# EAGLE design MurataBLE (EAGLE 7.5.0)
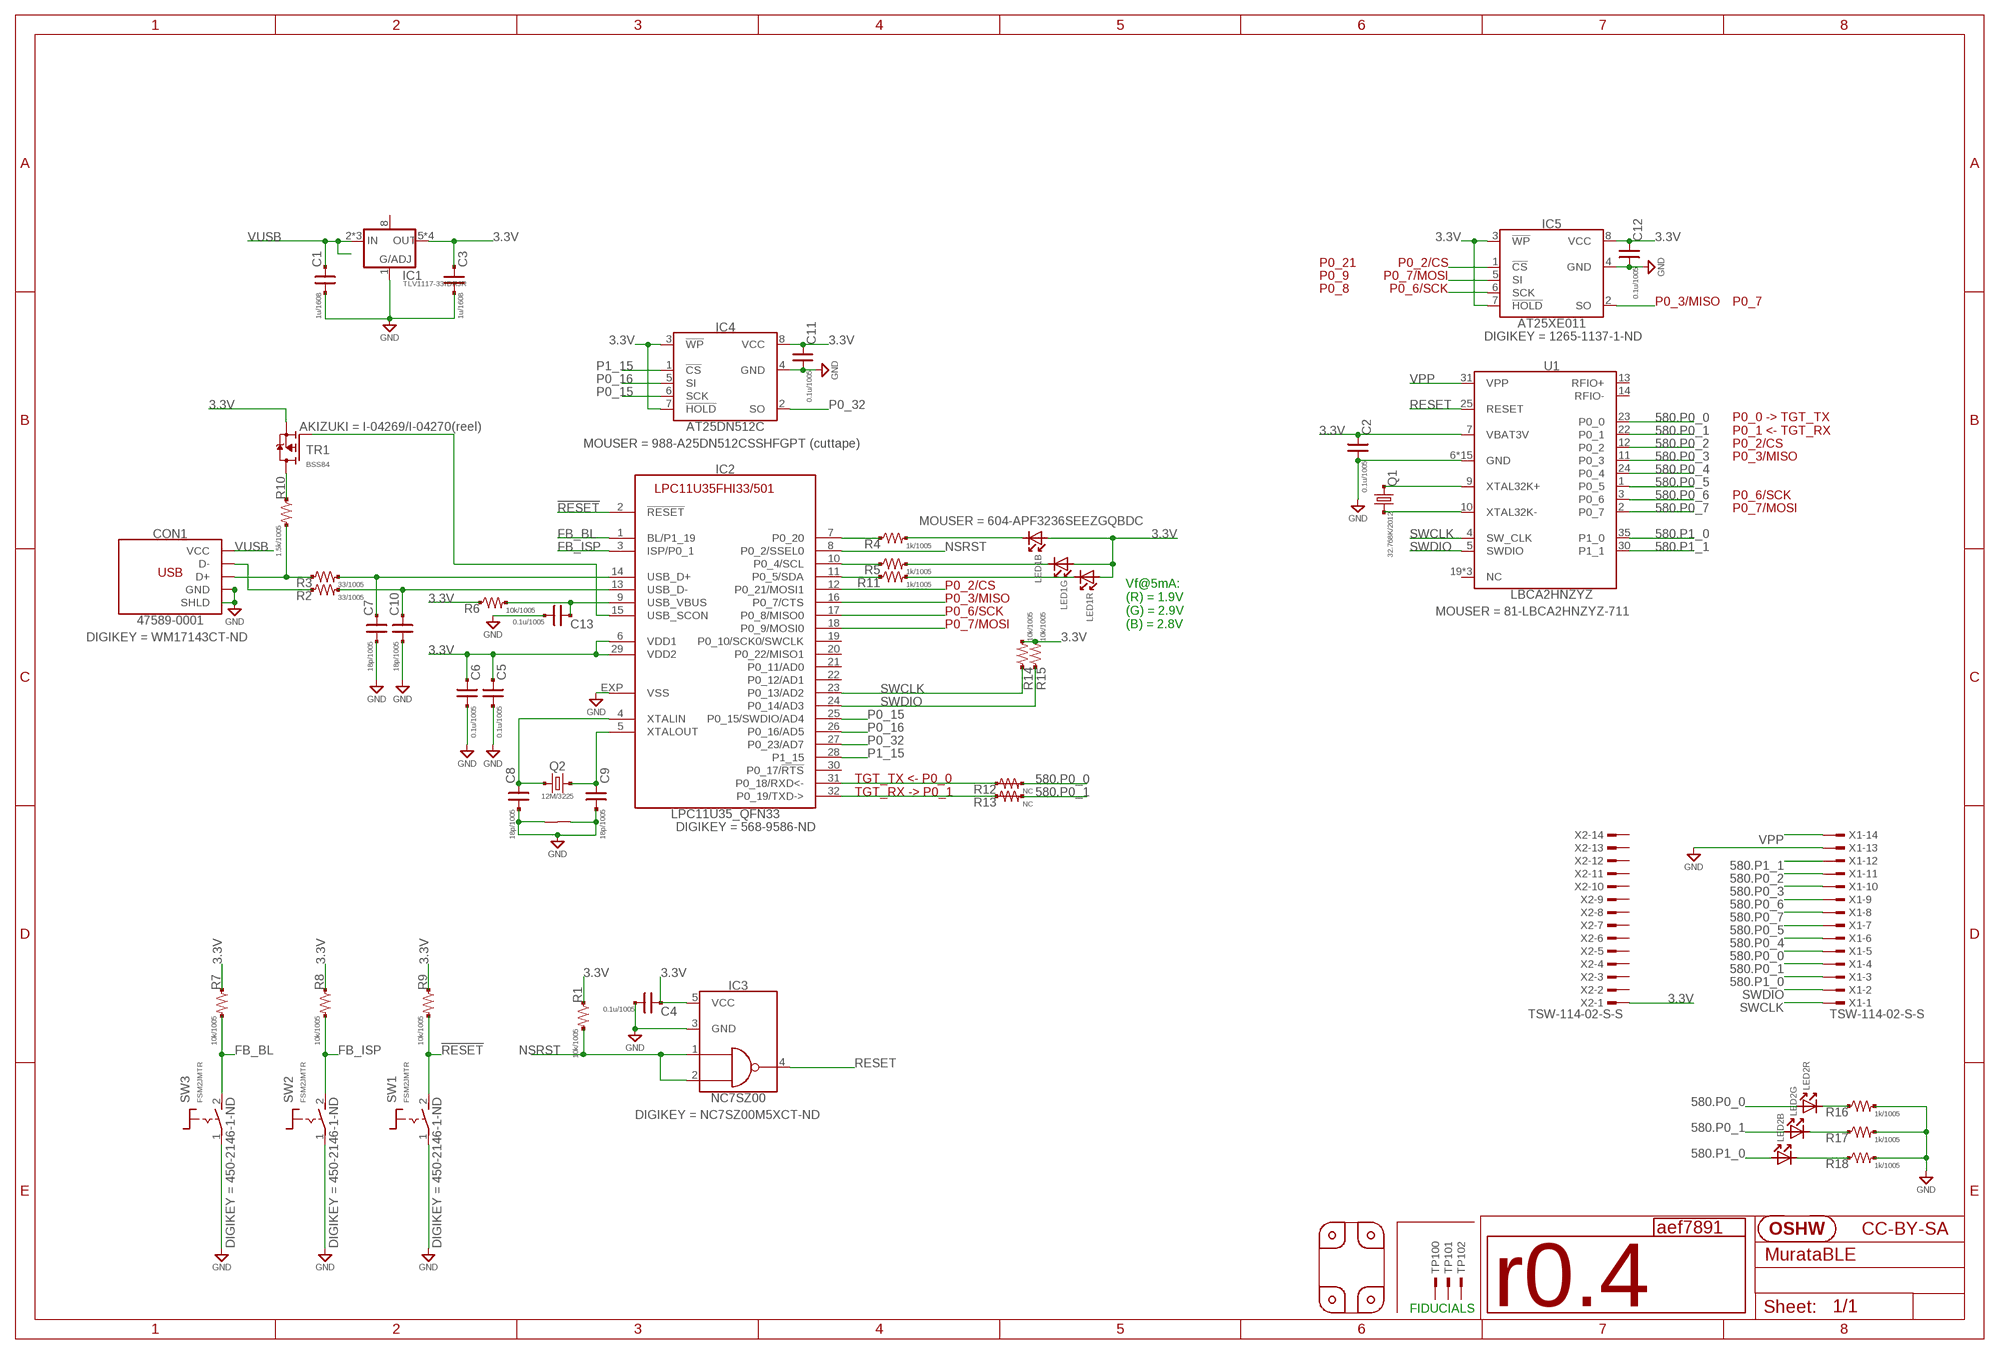
[diagram p0: schematic, sheet 1]

## Parts
C1  1u/1608  C_SMD_1.0U_1608  [CR_1608]
C2  0.1u/1005  C_SMD_0.1U_1005  [C0402]
C3  1u/1608  C_SMD_1.0U_1608  [CR_1608]
C4  0.1u/1005  C_SMD_0.1U_1005  [C0402]
C5  0.1u/1005  C_SMD_0.1U_1005  [C0402]
C6  0.1u/1005  C_SMD_0.1U_1005  [C0402]
C7  18p/1005  C_SMD_18P_1005  [C0402]
C8  18p/1005  C_SMD_18P_1005  [C0402]
C9  18p/1005  C_SMD_18P_1005  [C0402]
C10  18p/1005  C_SMD_18P_1005  [C0402]
C11  0.1u/1005  C_SMD_0.1U_1005  [C0402]
C12  0.1u/1005  C_SMD_0.1U_1005  [C0402]
C13  0.1u/1005  C_SMD_0.1U_1005  [C0402]
CON1  47589-0001  CON_USB_UB  [CON_USB_47589-0001MOLEX]
GIT1  aef7891  GIT-REVISION  [GIT-REVISION]
IC1  TLV1117-33IDRJR  LDO4_3.3_DRJ  [DFN80P410X410_8N]
IC2  LPC11U35_QFN33  IC_LPC11U35_QFN33_5X5  [HVQFN33]
IC3  NC7SZ00  IC_TTL_SINGLE_74_00_SOT23  [SOT95P280X145-5N]
IC4  AT25DN512C  IC_MEMORY_8P_AT25DN512C_SOP  [IC_08_1.27_150MIL]
IC5  AT25XE011  IC_MEMORY_8P_AT25XE011_SOP  [IC_08_1.27_150MIL]
ICON1  r0.4  ICON_REVISION_1.2  [ICON_REVISION1.2]
ICON2  NC  ICON_OSHW  [ICON_OSHW]
LED1  LED_3SEG  [LED_3SEG_SMD]
LED2  LED_3SEG  [LED_3SEG_SMD]
P1  NC  PCB_CORNER_NH  [PCB_CORNER_NH]
P2  NC  PCB_CORNER_NH  [PCB_CORNER_NH]
P3  NC  PCB_CORNER_NH  [PCB_CORNER_NH]
P4  NC  PCB_CORNER_NH  [PCB_CORNER_NH]
Q1  32.768K/2012  CRYSTAL2_32.768K_2012  [CR_2125]
Q2  12M/3225  CRYSTAL4_12M_3225  [CLOCK_3225]
R1  10k/1005  R_US_10K_1005  [C0402]
R2  33/1005  R_US_33R_1005  [C0402]
R3  33/1005  R_US_33R_1005  [C0402]
R4  1k/1005  R_US_1.0K_1005  [C0402]
R5  1k/1005  R_US_1.0K_1005  [C0402]
R6  10k/1005  R_US_10K_1005  [C0402]
R7  10k/1005  R_US_10K_1005  [C0402]
R8  10k/1005  R_US_10K_1005  [C0402]
R9  10k/1005  R_US_10K_1005  [C0402]
R10  1.5k/1005  R_US_1.5K_1005  [C0402]
R11  1k/1005  R_US_1.0K_1005  [C0402]
R12  NC  R_US__1005SHORT  [R0402SHORT]
R13  NC  R_US__1005SHORT  [R0402SHORT]
R14  10k/1005  R_US_10K_1005  [C0402]
R15  10k/1005  R_US_10K_1005  [C0402]
R16  1k/1005  R_US_1.0K_1005  [C0402]
R17  1k/1005  R_US_1.0K_1005  [C0402]
R18  1k/1005  R_US_1.0K_1005  [C0402]
SW1  FSM2JMTR  TACTSW2_FSM2JMTR  [SW_TACTSW_FSM2JMTR]
SW2  FSM2JMTR  TACTSW2_FSM2JMTR  [SW_TACTSW_FSM2JMTR]
SW3  FSM2JMTR  TACTSW2_FSM2JMTR  [SW_TACTSW_FSM2JMTR]
TP100  NC  TESTPAD_F  [FIDUCIAL]
TP101  NC  TESTPAD_F  [FIDUCIAL]
TP102  NC  TESTPAD_F  [FIDUCIAL]
TR1  BSS84  PMOS_BSS84_SOT23  [SOT95P300X140-3N]
U1  LBCA2HNZYZ  LBCA2HNZYZ-711  [IC_MURATA_LBCA2HNZYZ-711]
X1  TSW-114-02-S-S  [TSW-114-07-F-S]
X2  TSW-114-02-S-S  [TSW-114-07-F-S]

## Nets
3.3V: C2.1 C3.1 C4.1 C5.1 C6.1 C11.1 C12.1 IC1.5(OUT) IC1.6(OUT) IC1.7(OUT) IC1.EP(OUT) IC2.6(VDD1) IC2.29(VDD2) IC3.5(VCC) IC4.3(!WP) IC4.7(!HOLD) IC4.8(VCC) IC5.3(!WP) IC5.7(!HOLD) IC5.8(VCC) LED1.4(R:A) LED1.5(G:A) LED1.6(B:A) R1.1 R6.1 R7.1 R8.1 R9.1 R14.2 R15.2 TR1.2(S) U1.7(VBAT3V) X2.1
580.P0_0: LED2.4(R:A) R12.3 U1.23(P0_0) X1.5
580.P0_1: LED2.5(G:A) R13.3 U1.22(P0_1) X1.4
580.P0_2: IC2.12(P0_21/MOSI1) IC5.1(!CS) U1.12(P0_2) X1.11
580.P0_3: IC2.16(P0_7/CTS) IC5.2(SO) U1.11(P0_3) X1.10
580.P0_4: U1.24(P0_4) X1.6
580.P0_5: U1.1(P0_5) X1.7
580.P0_6: IC2.17(P0_8/MISO0) IC5.6(SCK) U1.3(P0_6) X1.9
580.P0_7: IC2.18(P0_9/MOSI0) IC5.5(SI) U1.2(P0_7) X1.8
580.P1_0: LED2.6(B:A) U1.35(P1_0) X1.3
580.P1_1: U1.30(P1_1) X1.12
!RESET!: IC2.2(!RESET!) R9.2 SW1.2(S)
FB_BL: IC2.1(BL/P1_19) R7.2 SW3.2(S)
FB_ISP: IC2.3(ISP/P0_1) R8.2 SW2.2(S)
GND: C1.2 C2.2 C3.2 C4.2 C5.2 C6.2 C7.2 C8.2 C9.2 C10.2 C11.2 C12.2 C13.2 CON1.5(GND) CON1.SHD$1(SHLD) CON1.SHD$2(SHLD) CON1.SHD$3(SHLD) CON1.SHD$4(SHLD) CON1.SHD$5(SHLD) CON1.SHD$6(SHLD) CON1.SHD$7(SHLD) CON1.SHD(SHLD) IC1.1(ADJ) IC2.EXP(VSS) IC3.3(GND) IC4.4(GND) IC5.4(GND) Q2.2 Q2.4 R16.2 R17.2 R18.2 SW1.1(P) SW2.1(P) SW3.1(P) U1.6(GND) U1.8(GND) U1.15(GND) U1.16(GND) U1.17(GND) U1.18(GND) U1.20(GND) U1.21(GND) U1.26(GND) U1.27(GND) U1.28(GND) U1.29(GND) U1.32(GND) U1.33(GND) U1.34(GND) X1.13
N$2: Q1.1 U1.9(XTAL32K+)
N$3: Q1.2 U1.10(XTAL32K-)
N$4: C13.1 IC2.9(USB_VBUS) R6.2
N$6: R10.1 TR1.3(D)
N$7: IC2.15(USB_SCON) TR1.1(G)
N$8: IC2.7(P0_20) R4.1
N$9: IC2.10(P0_4/SCL) R5.1
N$10: IC2.11(P0_5/SDA) R11.1
N$11: LED1.1(R:K) R11.2
N$12: LED1.2(G:K) R5.2
N$13: LED1.3(B:K) R4.2
N$14: LED2.3(B:K) R18.1
N$15: LED2.2(G:K) R17.1
N$16: LED2.1(R:K) R16.1
N$18: C8.1 IC2.4(XTALIN) Q2.1
N$19: C9.1 IC2.5(XTALOUT) Q2.3
N$20: C7.1 IC2.14(USB_D+) R3.2
N$21: CON1.3(D+) R3.1 R10.2
N$22: CON1.2(D-) R2.1
N$24: C10.1 IC2.13(USB_D-) R2.2
NSRST: IC2.8(P0_2/SSEL0) IC3.1(1A) IC3.2(1B) R1.2
P0_15: IC2.25(P0_15/SWDIO/AD4) IC4.6(SCK)
P0_16: IC2.26(P0_16/AD5) IC4.5(SI)
P0_32: IC2.27(P0_23/AD7) IC4.2(SO)
P1_15: IC2.28(P1_15) IC4.1(!CS)
RESET: IC3.4(1Y) U1.25(RESET)
SWCLK: IC2.23(P0_13/AD2) R14.1 U1.4(SW_CLK) X1.1
SWDIO: IC2.24(P0_14/AD3) R15.1 U1.5(SWDIO) X1.2
TGT_RX: IC2.32(P0_19/TXD->) R13.1 R13.2
TGT_TX: IC2.31(P0_18/RXD<-) R12.1 R12.2
VPP: U1.31(VPP) X1.14
VUSB: C1.1 CON1.1(VCC) IC1.2(IN) IC1.3(IN) IC1.4(IN)
Unconnected: IC1.8(OUT/EN/NC) IC2.19(P0_10/SCK0/SWCLK) IC2.20(P0_22/MISO1) IC2.21(P0_11/AD0) IC2.22(P0_12/AD1) IC2.30(P0_17/!RTS!) TP100.TP TP101.TP TP102.TP U1.13(RFIO+) U1.14(RFIO-) U1.19(NC) U1.36(NC) U1.37(NC) X2.2 X2.3 X2.4 X2.5 X2.6 X2.7 X2.8 X2.9 X2.10 X2.11 X2.12 X2.13 X2.14

## Notes on the sheet
- P0_21 | P0_2/CS
- P0_9 | P0_7/MOSI
- P0_8 | P0_6/SCK
- P0_3/MISO | P0_7
- P0_0 -> TGT_TX
  P0_1 <- TGT_RX
- P0_2/CS
- P0_3/MISO
- P0_6/SCK
- P0_7/MOSI
- P0_2/CS
- P0_3/MISO
- P0_6/SCK
- P0_7/MOSI
- Vf@5mA:
  (R) = 1.9V
  (G) = 2.9V
  (B) = 2.8V
- TGT_TX <- P0_0
  TGT_RX -> P0_1
- CC-BY-SA
- FIDUCIALS

## Library data of the parts
C1 C3 = mylib:C_SMD_*: SMD CAPACITOR; SEEED: 302010139
C2 C4-C6 C11-C13 = mylib:C_SMD_*: SMD CAPACITOR; DIGIKEY: 490-3261-1-ND; SEEED: 302010024
C7-C10 = mylib:C_SMD_*: SMD CAPACITOR; DIGIKEY: 490-5858-1-ND; SEEED: 302010016
CON1 = mylib:CON_USB: USB B CONNECTOR; DIGIKEY: WM17143CT-ND
GIT1 = git-revision:GIT-REVISION; NOT_COMPONENT: YES
IC1 = mylib:LDO4_*: LDO with 4 pins; DIGIKEY: 296-32364-1-ND
IC2 = mylib:IC_LPC11U*_QFN33; DIGIKEY: 568-9586-ND; SEEED: 310010053
IC3 = mylib:IC_TTL_SINGLE_74_00: SINGLE 2-INPUT POSITIVE-OR GATE; DIGIKEY: NC7SZ00M5XCT-ND
IC4 = mylib:IC_MEMORY_8P_*; MOUSER: 988-A25DN512CSSHFGPT (cuttape)
IC5 = mylib:IC_MEMORY_8P_*; DIGIKEY: 1265-1137-1-ND
ICON1 = mylib:ICON_REVISION; NOT_COMPONENT: YES
ICON2 = mylib:ICON_OSHW: Silk icon of OSHW; NOT_COMPONENT: YES
LED1 LED2 = mylib:LED_3SEG: Vf@5mA: (R) = 1.9V (G) = 2.9V (B) = 2.8V; MOUSER: 604-APF3236SEEZGQBDC
P1-P4 = mylib:PCB_CORNER; NOT_COMPONENT: YES
Q1 = mylib:CRYSTAL2_*; DIGIKEY: 1253-1342-1-ND
Q2 = mylib:CRYSTAL4_*: Crystal 4 pins; DIGIKEY: 1253-1168-1-ND
R1 R6-R9 R14 R15 = mylib:R_US_*: SMD resistor Packages : _1608 : 1.6 x 0.8 mm _2125 : 2.0 x 1.25 mm _3216 : 3.2 x 1.6 mm; DIGIKEY: P10.0KLCT-ND; SEEED: 301010047
R2 R3 = mylib:R_US_*: SMD resistor Packages : _1608 : 1.6 x 0.8 mm _2125 : 2.0 x 1.25 mm _3216 : 3.2 x 1.6 mm; DIGIKEY: P33.0LCT-ND; SEEED: 301010609
R4 R5 R11 R16-R18 = mylib:R_US_*: SMD resistor Packages : _1608 : 1.6 x 0.8 mm _2125 : 2.0 x 1.25 mm _3216 : 3.2 x 1.6 mm; DIGIKEY: P1.00KLCT-ND; SEEED: 301010006
R10 = mylib:R_US_*: SMD resistor Packages : _1608 : 1.6 x 0.8 mm _2125 : 2.0 x 1.25 mm _3216 : 3.2 x 1.6 mm; DIGIKEY: P1.50KLCT-ND; SEEED: 301010001
R12 R13 = mylib:R_US_*: SMD resistor Packages : _1608 : 1.6 x 0.8 mm _2125 : 2.0 x 1.25 mm _3216 : 3.2 x 1.6 mm; NOT_COMPONENT: YES
SW1-SW3 = mylib:TACTSW2_*: 2P tact switch; DIGIKEY: 450-2146-1-ND
TP100-TP102 = mylib:TESTPAD: test points; NOT_COMPONENT: YES
TR1 = mylib:PMOS_*; AKIZUKI: I-04269/I-04270(reel); DIGIKEY: BSS84CT-ND
U1 = mylib:LBCA2HNZYZ-711; DIGIKEY: 490-10561-1-ND; MOUSER: 81-LBCA2HNZYZ-711
X1 X2 = mylib:TSW-114-02-S-S: THROUGH-HOLE .025inch SQ POST HEADER Source: Samtec TSW.pdf; AKIZUKI: C-04397; NOT_COMPONENT: YES

## Net classes
0 default: clearance 0.15 mm

## Board
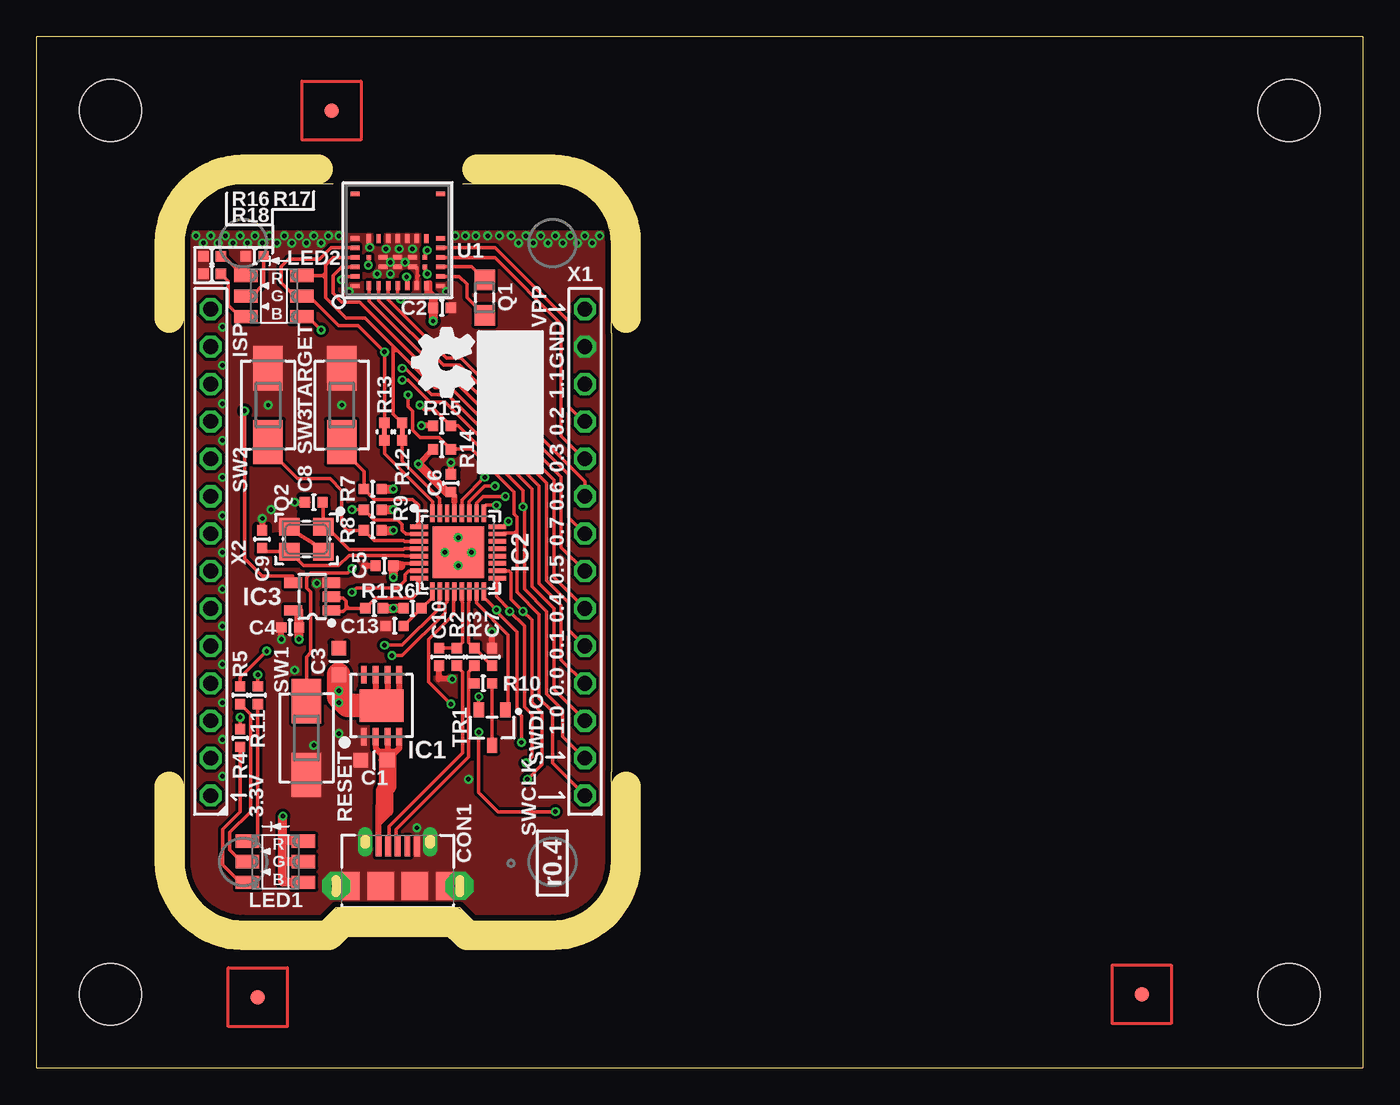
[diagram p1: board, top side]
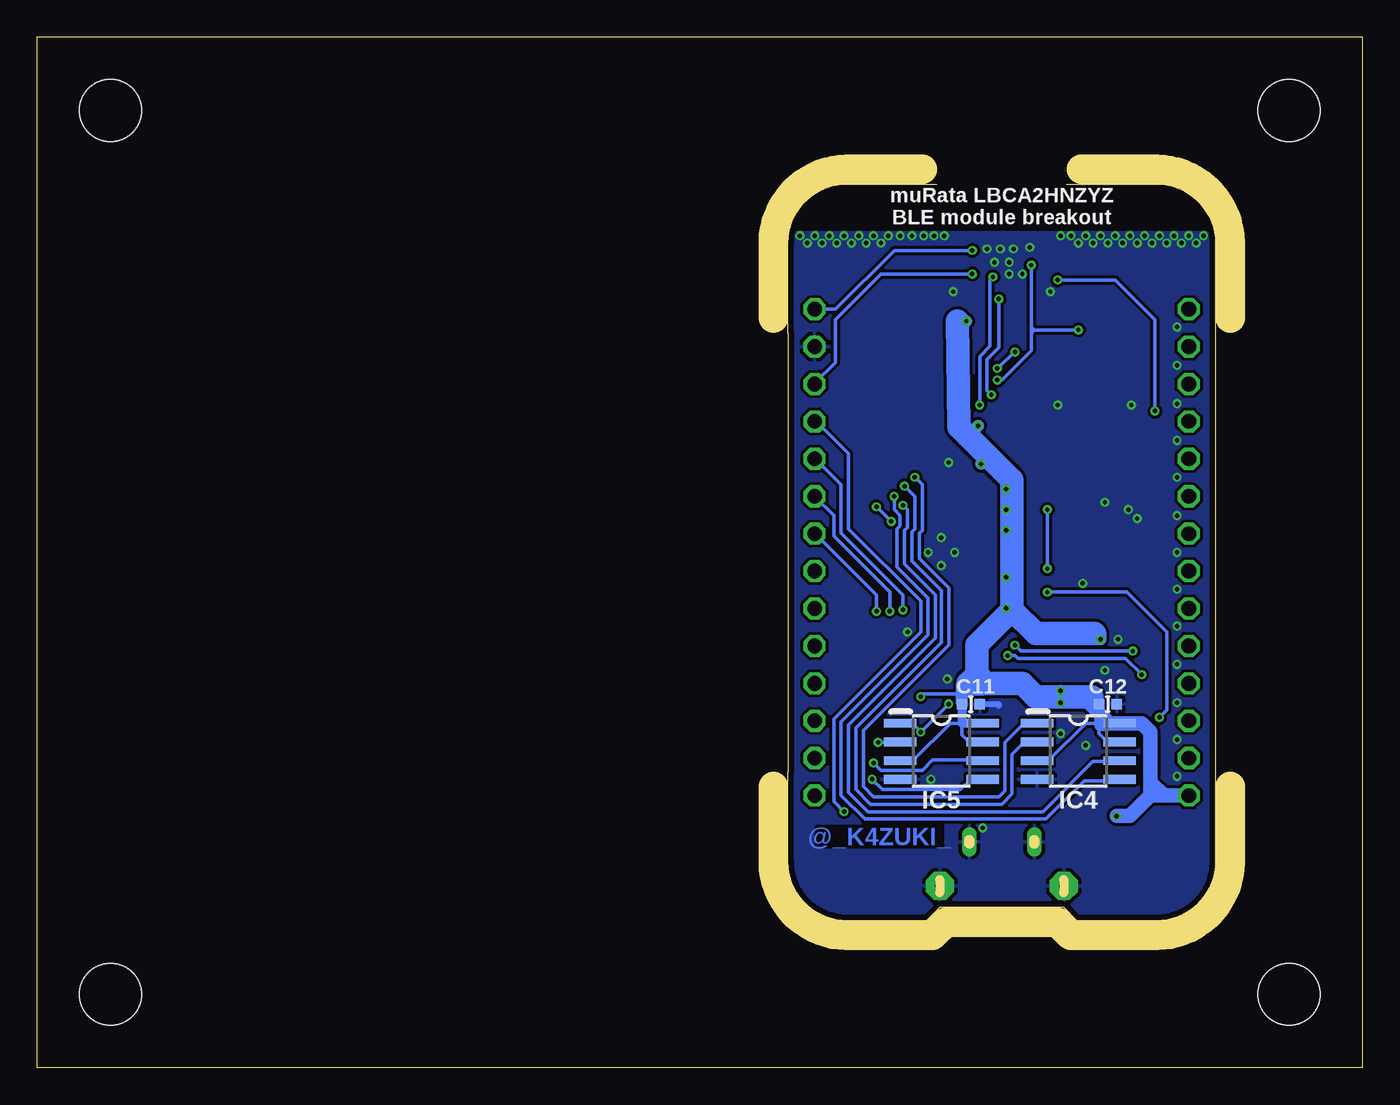
[diagram p2: board, bottom side, seen from below]

Size 90 x 70 mm. Coordinates in mm from the lower left corner, seen from the top.
Outline: 10,49.9 10,20.1
Outline: 39,49.9 39,20.1
Outline: 19.4,10 20.3,10.9 28.7,10.9 29.6,10
Outline: 0,0 0,70 90,70 90,0 0,0
Copper layers (1*16): Top 0.035mm / dielectric 1.5mm / Bottom 0.035mm
Design rules "default *": minimum track width 0.15mm, minimum drill 0.3mm, track to track 0.15mm, track to pad 0.15mm, pad to pad 0.15mm, via to via 0.15mm, smd to smd 0mil, copper to edge 0.4mm, drill to drill 0.15mm, minimum pad ring 0.15mm, minimum via ring 0.15mm, stop-mask expansion 0.05mm, vias tented up to drill 100mil, thermal gap 10mil
Holes 4.2 mm at 5,65 5,5 85,5 85,65
tRestrict: area 10,57.1 to 21.2,60; area 28.2,57.1 to 39,60; area 16.2,34.2 to 20.4,37.6; 24 lines
bRestrict: area 10,57.1 to 39,60
Milling: 5 lines

### Footprints (pad centres in the part's own frame; a part is rotated, then mirrored left to right if it is on the bottom)
CR_1608 = smd 1 x 1: 1 -0.9,0; 2 0.9,0
C0402 = smd 0.7 x 0.7: 1 -0.6,0; 2 0.6,0
CON_USB_47589-0001MOLEX = smd 0.4 x 1.4: 1 -1.3,4.15; 2 -0.65,4.15; 3 0,4.15; 4 0.65,4.15; 5 1.3,4.15 | drill 0.6 pad 1 long: SHD -2.2,4.45; SHD$1 2.2,4.45 | drill 0.6 pad 1.9 octagon: SHD$2 -4.2,1.45; SHD$3 4.2,1.45 | smd 1.6 x 1.9: SHD$4 -3.4,1.45; SHD$7 3.4,1.45 | smd 1.8 x 1.9: SHD$5 -1.15,1.45; SHD$6 1.15,1.45
DFN80P410X410_8N = smd 0.4 x 1.2: 1 -1.2,-2.1; 2 -0.4,-2.1; 3 0.4,-2.1; 4 1.2,-2.1; 5 1.2,2.1; 6 0.4,2.1; 7 -0.4,2.1; 8 -1.2,2.1 | smd 3 x 2.2: EP 0,0
HVQFN33 = smd 1.2 x 0.3: 1 -2.65,1.75; 2 -2.65,1.25; 3 -2.65,0.75; 4 -2.65,0.25; 5 -2.65,-0.25; 6 -2.65,-0.75; 7 -2.65,-1.25; 8 -2.65,-1.75; 17 2.65,-1.75; 18 2.65,-1.25; 19 2.65,-0.75; 20 2.65,-0.25; 21 2.65,0.25; 22 2.65,0.75; 23 2.65,1.25; 24 2.65,1.75 | smd 0.3 x 1.2: 9 -1.75,-2.65; 10 -1.25,-2.65; 11 -0.75,-2.65; 12 -0.25,-2.65; 13 0.25,-2.65; 14 0.75,-2.65; 15 1.25,-2.65; 16 1.75,-2.65; 25 1.75,2.65; 26 1.25,2.65; 27 0.75,2.65; 28 0.25,2.65; 29 -0.25,2.65; 30 -0.75,2.65; 31 -1.25,2.65; 32 -1.75,2.65 | smd 3.5 x 3.5: EXP 0,0
SOT95P280X145-5N = smd 1.2 x 0.7: 1 -1.3,0.95; 2 -1.3,0; 3 -1.3,-0.95; 4 1.3,-0.95; 5 1.3,0.95
IC_08_1.27_150MIL = smd 0.6 x 2.2: 1 -1.905,-2.8; 2 -0.635,-2.8; 3 0.635,-2.8; 4 1.905,-2.8; 5 1.905,2.8; 6 0.635,2.8; 7 -0.635,2.8 | smd 0.603 x 2.2: 8 -1.905,2.8
LED_3SEG_SMD = smd 1.6 x 0.9: 1 -1.9,1.4; 2 -1.9,0; 3 -1.9,-1.4; 4 1.9,1.4; 5 1.9,0; 6 1.9,-1.4
CR_2125 = smd 1.4 x 1.4: 1 -1.2,0; 2 1.2,0
CLOCK_3225 = smd 1.4 x 1.2: 1 -1.15,-0.85; 2 1.15,-0.85; 3 1.15,0.85; 4 -1.15,0.85
R0402SHORT = smd 0.7 x 0.7: 1 -0.6,0; 3 0.6,0 | smd 0.8 x 0.3: 2 0,0
SW_TACTSW_FSM2JMTR = smd 3 x 2: 1 -2.5,0; 2 2.5,0
FIDUCIAL = smd 1 x 1: TP 0,0
SOT95P300X140-3N = smd 0.7 x 1: 1 -0.9,-1.2; 2 0.9,-1.2; 3 0,1.2
IC_MURATA_LBCA2HNZYZ-711 = smd 0.3 x 0.6: 1 1.55,0.6; 2 2.2,0.6; 3 2.85,0.6; 4 3.5,0.6; 5 4.15,0.6; 6 4.8,0.6; 7 5.45,0.6; 14 5.45,3.8; 15 4.8,3.8; 16 4.15,3.8; 17 3.5,3.8; 18 2.85,3.8; 19 2.2,3.8; 20 1.55,3.8 | smd 0.6 x 0.3: 8 6.4,0.575; 9 6.4,1.225; 10 6.4,1.875; 11 6.4,2.525; 12 6.4,3.175; 13 6.4,3.825; 21 0.6,3.825; 22 0.6,3.175; 23 0.6,2.525; 24 0.6,1.875; 25 0.6,1.225; 26 0.6,0.575; 27 2.5,1.875; 28 3.5,1.875; 29 4.5,1.875; 32 4.5,2.525; 33 3.5,2.525; 34 2.5,2.525; 36 6.4,6.825; 37 0.6,6.825 | smd 0.3 x 0.3: 30 5.35,1.875; 31 5.35,2.525; 35 1.55,2.525
TSW-114-07-F-S = drill 1 pad 1.5 octagon: 1 16.51,0; 2 13.97,0; 3 11.43,0; 4 8.89,0; 5 6.35,0; 6 3.81,0; 7 1.27,0; 8 -1.27,0; 9 -3.81,0; 10 -6.35,0; 11 -8.89,0; 12 -11.43,0; 13 -13.97,0; 14 -16.51,0

### Placement (x,y rotation side)
C1  22.9,20.9 180 top
C2  27.5,51.6 0 top
C3  20.5,27.6 90 top
C4  17.2,29.9 180 top
C5  23.6,34.1 180 top
C6  28.1,39.7 90 top
C7  30.9,27.9 90 top
C8  18.8,38.4 180 top
C9  15.3,35.9 90 top
C10  27.3,27.9 270 top
C11  26.6,24.7 0 bottom
C12  17.3,24.7 0 bottom
C13  24.3,30 180 top
CON1  24.5,10.9 0 top
GIT1  32.2,13.9 90 top
IC1  23.4,24.6 0 top
IC2  28.6,35 0 top
IC3  18.7,32 180 top
IC4  19.3,21.5 270 bottom
IC5  28.6,21.5 270 bottom
ICON1  35,14 90 top
ICON2  27.8,47.9 90 top
LED1  16.2,14 0 top
LED2  16.1,52.4 0 top
P1  35,14 0 top
P2  35,56 90 top
P3  14,56 180 top
P4  14,14 270 top
Q1  30.4,52.3 90 top
Q2  18.3,35.9 180 top
R1  22.9,31.2 180 top
R2  28.5,27.9 90 top
R3  29.7,27.9 90 top
R4  13.8,22.4 270 top
R5  13.8,25.3 270 top
R6  25.5,31.2 0 top
R7  22.8,39.3 180 top
R8  22.8,36.5 180 top
R9  22.8,37.9 180 top
R10  30.3,26.1 180 top
R11  15,25.3 270 top
R12  24.8,43.2 90 top
R13  23.6,43.2 90 top
R14  27.5,42 180 top
R15  27.5,43.6 180 top
R16  11.9,55.1 180 top
R17  14.8,55.1 180 top
R18  11.9,53.9 180 top
SW1  18.3,22.4 90 top
SW2  15.7,45 270 top
SW3  20.7,45 270 top
TP100  15,4.8 0 top
TP101  75,5 0 top
TP102  20,65 0 top
TR1  30.9,23.1 180 top
U1  21,52.5 0 top
X1  37.2,35 270 top
X2  11.8,35 270 top

### Tracks (layer width: path | path; a pad name or v marks a point on that pad's centre or on a via)
3.3V  (via drill 0.3)
  Top 0.25: IC2.6 24.85,34.25 24.8,34.2 | IC2.29 28.35,38.45 | TR1.2 v30,25.2 | IC3.5 17.75,31.05 17.8,31
  Top 0.3: U1.7 26.45,52.6 26.6,52.6 | 26.6,52.6 26.6,53.3 | 26.6,53.3 26.5,53.3 | 26.6,52.6 26.7,52.6 26.7,53.3 26.6,53.3
  Top 0.4: 24.8,34.2 24.7,34.1 | 28.35,38.45 28.35,38.85 C6.1 | v25.9,41 R14.2 | R15.2 v26.1,43.6 | IC1.7 23,25 IC1.EP 23.8,25 | IC1.6 23.8,25 | IC1.5 24.6,25 23.8,25
  Top 0.6: 26.6,52.6 26.9,52.3 C2.1 v26.9,50.7 | v24.2,33.3 C5.1 24.7,34.1 | v17.8,29.1 C4.1 17.8,31 | C6.1 27.8,39.1 v25.9,41 | R8.1 v24.2,36.5 | R9.1 v24.2,37.9 | R7.1 v24.2,39.3 | R6.1 v24.2,31.2 R1.1 | LED1.6 16.7,12.6 16.7,14 | 16.7,14 16.7,15.4 | 16.7,15.4 v16.7,17.1 | LED1.4 16.7,15.4 | LED1.5 16.7,14
  Top 0.8: v20.5,24.8 20.5,25.2 v20.5,25.6
  Top 1.6: IC1.EP 21.1,24.6 20.5,25.2 | v20.5,25.6 C3.1
  Bottom 0.25: IC5.3 31.4,20.9 30.5,20.9 28,23.4 27.2,23.4 27.2,22.6 26.8,22.2 25.8,22.2 IC5.7 | IC4.7 16.54,22.14 16.6,22.2 17.4,22.2 17.9,22.7 17.9,23.2 | IC4.3 22.1,20.9 21.3,20.9 18.8,23.4 17.9,23.4 | v30,25.2 29.8,25.4 27.2,25.4
  Bottom 0.6: IC5.8 27.2,23.4 C11.1 | IC4.8 | 17.9,23.4 17.9,24.1 C12.1 | C12.1 18.5,24.7 | C12.1 17.9,25.2 18.4,25.2 | 17.7,23.4 17.9,23.4 | 17.9,23.4 17.9,23.2 17.4,23.2
  Bottom 0.8: 23.8,31.2 v24.2,31.2 24.2,30.8 | v24.2,33.3 23.8,33.3 | v24.2,36.5 23.8,36.5 | v24.2,39.3 23.8,39.3 | 23.8,37.9 v24.2,37.9 | 27.5,50.7 v26.9,50.7 | C11.1 27.2,25.4 27.2,25.7 | v25.9,41 25.4,41.5 | v26.1,43.6 26.8,42.9 | 27.2,25.7 26.8,26.1 | 27.2,25.7 27.2,26.1 | 27.2,25.7 25.7,25.7 | v20.5,24.8 20.5,25.2 v20.5,25.6 | 17.8,29.5 18.2,29.5 18.2,29.1 v17.8,29.1 17.8,29.5
  Bottom 1: IC4.8 17.2,23.4 | v16.7,17.1 15.8,17.1 14.4,18.5 | 14.4,18.5 14.4,19.4 | 14.4,19.4 14.4,22.8 15.01,23.41 IC4.8 | 17.2,23.4 17.9,24.1 18.5,24.7 18.7,24.9 | 17.2,23.4 17.7,23.4 | X2.1 13.5,18.5 | 13.5,18.5 14.4,18.5 | 14.4,19.4 13.5,18.5
  Bottom 1.6: 23.8,31.1 22.2,29.5 18.2,29.5 | 23.8,31.1 23.8,31.2 23.8,33.3 23.8,36.5 23.8,37.9 23.8,39.3 23.8,39.9 25.4,41.5 26.8,42.9 27.4,43.5 27.5,50.7 | 23.8,31.1 26.2,28.7 26.2,26.7 | 26.2,26.7 26.8,26.1 25.6,26.1 | 26.2,26.7 25.6,26.1 | 25.6,26.1 23.1,26.1 22.2,25.2 20.5,25.2 18.4,25.2
580.P0_0
  Top 0.25: 19.6,53.6 19.6,52.3 21,50.9 22.3,50.9 24.2,49 | 24.2,48.7 24.2,49 | 24.5,48.7 24.2,49 | 24.2,48.7 24.3,48.7 | 24.3,48.7 24.5,48.7 | 24.5,48.7 27,46.2 28.1,46.2 34.6,39.7 34.6,33.1 36.1,31.6 36.1,29.75 X1.5 | U1.23 20.12,55.02 19.6,54.5 19.6,54 | 24.2,48.6 24.2,44.4 R12.3 | 24.2,48.6 24.2,48.7 | 24.2,48.6 24.3,48.7 | LED2.4 19.4,53.8 | 19.4,53.8 19.6,53.6 | 19.4,53.8 19.6,54 | 19.6,54 19.6,53.6
580.P0_1  (via drill 0.3)
  Top 0.25: v24.8,47.5 25,47.5 26.8,45.7 27.9,45.7 34.1,39.5 34.1,32.9 35.6,31.4 35.6,27.71 X1.4 | U1.22 19.98,55.67 19.2,54.9 17.1,54.9 16.6,54.4 16.6,53.3 17.5,52.4 LED2.5 18.5,52.4 20.5,50.4 21.8,50.4 v23.6,48.6 R13.3
  Bottom 0.25: v23.6,48.6 v24.8,47.5
580.P0_2  (via drill 0.3)
  Top 0.25: U1.12 27.48,55.67 27.5,55.7 31.1,55.7 36.1,50.7 36.1,44.9 37.11,43.89 X1.11 | IC2.12 28.35,31.75 28.3,31.7 28.3,30.8 26.6,29.1 26.6,26.2 v28.1,24.7 | v35.2,17.4 31.3,17.4 30,18.7 v30,22.8
  Bottom 0.25: IC5.1 30.6,23.4 v30,22.8 v28.1,24.7 | v35.2,17.4 35.9,18.1 35.9,23.7 30,29.6 30,31.7 34.9,36.6 34.9,41.7 37.1,43.9 X1.11
580.P0_3  (via drill 0.3)
  Top 0.25: X1.10 37.15,41.35 35.6,42.9 35.6,50.5 31.1,55 27.5,55 27.48,55.02 U1.11 | IC2.16 30.35,31.95 v31.2,31.1 31.2,31 32.6,29.6 32.6,24.2 32.9,23.9 v32.9,22.1
  Bottom 0.25: IC5.2 31.46,22.14 31.5,22.1 v32.9,22.1 | X1.10 37.2,41.4 35.4,39.6 35.4,36.3 31.2,32.1 v31.2,31.1
580.P0_4
  Top 0.25: X1.6 35.1,33.29 35.1,39.9 28.3,46.7 27.2,46.7 21.9,52 20.7,52 20.1,52.6 20.1,53.8 20.68,54.38 U1.24
580.P0_5
  Top 0.25: U1.1 22.55,52.05 27.4,47.2 28.5,47.2 35.6,40.1 35.6,35.33 X1.7
580.P0_6  (via drill 0.3)
  Top 0.25: U1.3 23.85,52.15 27.8,48.2 28.8,48.2 37.2,39.8 X1.9 | IC2.17 31.2,33.2 31.2,33 | 31.2,33 31.2,32 32.1,31.1 v32.1,31 33.1,30 33.1,24.5 33.6,24 33.6,21.1 v33.2,20.7 | 31.2,33 31,33.2 | 31.2,33 31.4,33.2
  Bottom 0.25: IC5.6 25.8,20.9 29.2,20.9 29.9,20.2 32.7,20.2 v33.2,20.7 | X1.9 35.9,37.5 35.9,36.1 32.1,32.3 v32.1,31
580.P0_7  (via drill 0.3)
  Top 0.25: U1.2 23.2,52.1 27.6,47.7 28.7,47.7 36.1,40.3 36.1,37.37 X1.8 | IC2.18 32.05,33.75 32.2,33.6 32.2,31.8 v33,31 33.6,30.4 33.6,24.8 34.3,24.1 34.3,20.6 v33.3,19.6
  Bottom 0.25: v33.3,19.6 32.6,18.9 27.3,18.9 26.6,19.6 25.9,19.6 25.89,19.59 IC5.5 | X1.8 37.13,36.2 37.1,36.2 33,32.1 v33,31
580.P1_0  (via drill 0.3)
  Top 0.25: U1.35 22.55,54.55 v22.5,54.5 | v24.8,46.7 25.2,46.7 26.7,45.2 27.7,45.2 33.6,39.3 33.6,32.7 35.1,31.2 35.1,25.7 37.2,23.6 X1.3 | LED2.6 18.4,51 v19.3,50.1
  Bottom 0.25: v22.5,54.5 22.5,50.3 | 22.5,50.3 22.5,49.9 | 22.5,49.9 22.5,48.7 24.5,46.7 v24.8,46.7 | v19.3,50.1 22.3,50.1 | 22.3,50.1 22.5,49.9 | 22.3,50.1 22.5,50.3
580.P1_1  (via drill 0.3)
  Top 0.25: U1.30 26.35,54.05 v26.5,53.9
  Bottom 0.25: X1.12 37.2,46.5 35.8,47.9 35.8,50.8 32.7,53.9 v26.5,53.9
!RESET!  (via drill 0.3)
  Top 0.25: IC2.2 25.05,36.25 24.8,36.5 24.8,36.9 24.5,37.2 22.9,37.2 R9.2 v21.4,37.9 | SW1.2 18.3,27.9 18.6,28.2 18.6,32.3 18.3,32.6 18.3,33.3 18.6,33.6 21.1,33.6 v21.4,33.9
  Bottom 0.25: v21.4,37.9 v21.4,33.9
FB_BL
  Top 0.25: 25.9,37 25.9,38.2 25.5,38.6 22.9,38.6 R7.2 22.2,40.5 20.7,42 SW3.2 | 25.9,37 25.9,36.8 IC2.1 | 25.9,37 25.7,36.8 | 25.9,37 26.1,36.8
FB_ISP
  Top 0.25: SW2.2 15.7,42 17.7,40 19.9,40 20.7,39.2 20.7,36.9 21.1,36.5 R8.2 22.9,35.8 24.9,35.8 24.95,35.75 IC2.3
GND  (via drill 0.3, 0.3 pad 0.45)
  Top 0.25: Q2.4 19.35,35.05 18.8,35.6 17.8,36.2 17.25,36.75 Q2.2 | U1.6 25.8,54.33 25.5,54.33 | 25.8,53.7 25.9,53.8 | v29.5,35 IC2.EXP
  Top 0.4: v15.3,37.3 C9.2 | v17.5,38.4 18.4,38.4 | v28.1,41.1 C6.2 | 22.2,34.1 C5.2 | C7.2 v30.9,29.6 | v28.2,26.4 27.3,26.4 C10.2
  Top 0.406: v16.6,29.1 C4.2
  Bottom 0.4: C11.2 24.7,24.7 24.7,24.6
  other vias: 21.2,52.7 22.6,55.7 24.6,55.6 27.8,52.7 25.5,55.6 23.1,53.9 23.7,55.6 15.9,37.9 18.8,56.5 16.8,56.5 31.4,56.5 32.2,56.5 33.2,56.5 17.8,56.5 17.3,56 18.3,56 32.7,56 24,54.7 25,54.7 24,53.9 27.7,35 28.6,34.1 28.6,36 15.7,45 20.7,45 29.3,19.6 20.5,22.7 19,32.9 17.5,27 18.8,21.9 16.3,56 15.8,56.5 15.3,56 14.8,56.5 14.3,56 13.8,56.5 13.3,56 12.8,56.5 12.3,56 11.8,56.5 11.3,56 10.8,56.5 33.7,56 34.2,56.5 34.7,56 35.2,56.5 35.7,56 36.2,56.5 36.7,56 37.2,56.5 37.7,56 38.2,56.5 19.3,56 19.8,56.5 20.5,56.5 30.6,56.5 29.8,56.5 29.1,56.5 28.4,56.5 12.6,50.3 12.6,47.7 12.6,45.1 12.6,42.6 12.6,40.1 12.6,37.5 12.6,35 12.6,32.5 12.6,30 12.6,27.4 12.6,24.8 12.6,22.3 12.6,19.8 25.8,16.3
  pour Top (isolate 0.2, no thermals): 10,10 10,60 39,60 39,10
  pour Bottom (isolate 0.2): 10,10 10,60 39,60 39,10
N$2
  Top 0.25: U1.9 28.68,53.73 29.2,53.2 29.2,52.3 Q1.1
N$3
  Top 0.25: U1.10 27.48,54.38 27.5,54.4 29.5,54.4 Q1.2
N$4
  Top 0.25: IC2.9 26.85,31.95 R6.2 C13.1
N$6
  Top 0.25: TR1.3 R10.1
N$7
  Top 0.25: IC2.15 29.85,31.55 32,29.4 32,24.5 TR1.1
N$8  (via drill 0.3)
  Top 0.25: IC2.7 25.25,33.75 25,33.5 25,33.1 24.5,32.6 21.7,32.6 v21.4,32.3 | R4.1 v13.8,23.8
  Bottom 0.25: v13.8,23.8 13.3,24.3 13.3,29.6 16,32.3 v21.4,32.3
N$9  (via drill 0.3)
  Top 0.25: IC2.10 27.35,31.85 27.3,31.8 27.3,31.2 24.8,28.7 v23.6,28.7 | v15.6,28.3 13.8,26.5 R5.1
  Bottom 0.25: v15.6,28.3 23.2,28.3 v23.6,28.7
N$10  (via drill 0.3)
  Top 0.25: IC2.11 27.85,31.65 27.7,31.5 27.7,30.9 24.8,28 v24.1,28 | R11.1 v15,26.7
  Bottom 0.25: v24.1,28 23.6,28 23.4,27.8 16.1,27.8 v15,26.7
N$11
  Top 0.25: LED1.1 14.6,15.4 15,15.8 R11.2
N$12
  Top 0.25: LED1.2 13.9,14 13.1,14.8 13.1,16 14.5,17.4 14.5,24 R5.2
N$13
  Top 0.25: LED1.3 13.8,12.6 12.6,13.8 12.6,16.2 13.8,17.4 R4.2
N$14
  Top 0.25: LED2.3 13.8,51 13,51.8 13,53.4 R18.1
N$15
  Top 0.25: LED2.2 14.6,52.4 15.4,53.2 R17.1
N$16
  Top 0.25: R16.1 12.7,55.1 14,53.8 LED2.1
N$18
  Top 0.25: C8.1 19.45,38.35 Q2.1 19.65,36.75 21.2,35.2 24.9,35.2 24.95,35.25 IC2.4
N$19
  Top 0.25: C9.1 15.55,35.05 Q2.3 18.1,34.1 20.5,34.1 21.2,34.8 24.9,34.8 24.95,34.75 IC2.5
N$20
  Top 0.25: IC2.14 29.35,31.65 29.3,31.6 29.3,28.9 R3.2 C7.1
N$21
  Top 0.25: R3.1 29.3,26.9 29.3,26.1 | 29.3,26.1 29.3,21.1 24.4,16.2 24.4,15.6 24.5,15.5 CON1.3 | R10.2 29.3,26.1
N$22
  Top 0.25: CON1.2 23.85,15.55 23.9,15.6 23.9,16.4 28.9,21.4 28.9,26.9 R2.1
N$24
  Top 0.25: IC2.13 28.85,31.65 28.9,31.6 28.9,28.9 R2.2 C10.1
NSRST
  Top 0.25: IC2.8 25.9,33.2 25.9,33 | 25.9,33 25.9,32.3 25.5,31.9 23,31.9 R1.2 21.2,31.2 | 25.9,33 25.7,33.2 | 25.9,33 26.1,33.2 | IC3.2 20,31.9 20.8,31.9 21,31.7 21,31.4 | IC3.1 20,31 20.8,31 21,31.2 | 21,31.4 21,31.2 | 21,31.2 21.2,31.2 | 21,31.4 21.2,31.2
P0_15  (via drill 0.3)
  Top 0.25: IC2.25 30.4,37.7 30.4,38.1 30.5,38.2 v31.2,38.2
  Bottom 0.25: IC4.6 16.5,20.8 18.3,20.8 21.7,17.4 33.6,17.4 34.9,18.7 34.9,23.3 29,29.2 29,32.1 31.1,34.2 31.1,36.5 30.9,36.7 30.9,37.9 v31.2,38.2
P0_16  (via drill 0.3)
  Top 0.25: IC2.26 29.85,38.35 30.3,38.8 v31.8,38.8
  Bottom 0.25: IC4.5 16.5,19.5 18.9,19.5 21.5,16.9 33.8,16.9 35.4,18.5 35.4,23.5 29.5,29.4 29.5,31.9 31.6,34 31.6,36.6 31.4,36.8 31.4,37.5 31.8,37.9 v31.8,38.8
P0_32  (via drill 0.3)
  Top 0.25: IC2.27 29.35,38.45 30.4,39.5 v31.1,39.5
  Bottom 0.25: IC4.2 22.96,22.14 23.8,21.3 23.8,18.6 24.5,17.9 33.4,17.9 34.4,18.9 34.4,23.1 28.6,28.9 28.6,32.4 30.6,34.4 30.6,36.4 30.4,36.6 30.4,38.8 v31.1,39.5
P1_15  (via drill 0.3)
  Top 0.25: IC2.28 28.85,38.55 v30.4,40.1
  Bottom 0.25: IC4.1 23,23.41 24.3,22.1 24.3,18.8 24.7,18.4 33.2,18.4 33.9,19.1 33.9,22.9 28.1,28.7 28.1,32.6 30.1,34.6 30.1,36.3 29.9,36.5 29.9,39.6 v30.4,40.1
RESET  (via drill 0.3)
  Top 0.25: v14.1,44.6 14.1,34.6 15.3,33.4 17.35,33.4 IC3.4 | U1.25 20.93,53.73 v20.7,53.5
  Bottom 0.25: v14.1,44.6 14.1,50.8 16.8,53.5 v20.7,53.5
SWCLK  (via drill 0.3)
  Top 0.25: U1.4 24.5,52.4 v24.7,52.2 | X1.1 35,20.7 35,24.2 34.1,25.1 34.1,30.8 32.6,32.3 32.6,36.1 | 32.6,36.1 32.6,36.3 | 32.6,36.3 32.6,36.5 | 32.6,36.5 32.6,37.4 32.4,37.6 32.4,39.1 29.5,42 R14.1 27.3,42.8 26,42.8 25.5,43.3 25.5,44.6 25.2,44.9 v25.2,45.7 | IC2.23 31.65,36.25 31.7,36.3 32.4,36.3 | 32.4,36.3 32.6,36.3 | 32.4,36.3 32.6,36.5 | 32.4,36.3 32.6,36.1
  Bottom 0.25: v24.7,52.2 24.7,48.9 25.5,48.1 25.5,46 v25.2,45.7
SWDIO  (via drill 0.3)
  Top 0.25: U1.5 25.15,53.65 v25.1,53.7 | 37.2,21.1 X1.2 37.17,21.03 35.7,22.5 35.7,24.3 34.6,25.4 34.6,31 33.1,32.5 33.1,38 v33,38.1 33,39.2 28.6,43.6 R15.1 27,44.7 26.3,44.7 v26,45 | IC2.24 31.65,36.75 v32,37.1
  Bottom 0.25: v25.1,53.7 25.3,53.5 25.3,49 26,48.3 v26,45 | v32,37.1 v33,38.1
TGT_RX
  Top 0.25: IC2.32 26.85,38.45 23.6,41.7 R13.1 R13.2
TGT_TX
  Top 0.25: IC2.31 27.35,38.65 24.8,41.2 R12.1 R12.2
VPP  (via drill 0.3)
  Top 0.25: U1.31 26.35,55.35 v26.5,55.5
  Bottom 0.25: v26.5,55.5 31.8,55.5 35.8,51.5 37,51.5 37.01,51.51 X1.14
VUSB
  Top 0.4: CON1.1 23.2,16.6 | IC1.3 23.8,21.5 | 23.8,21.5 C1.1 | IC1.2 23,21.7 23.2,21.5 | 23.2,21.5 23.4,21.3 | 23.4,21.3 C1.1 | IC1.4 24.6,21.7 24.4,21.5 | 24.4,21.5 24.2,21.3 | 24.2,21.3 C1.1 | 23.2,21.5 23.8,21.5 | 23.8,21.5 24.4,21.5 | 23.2,16.6 23.6,17 | 23.6,17 23.8,17.2 | 23.8,17.2 24,17.4 24,17.8 23.6,17.8 23.6,17 | 23.4,21.3 23.4,20.9 | 24.2,21.3 24.2,20.9 | 23.2,16.6 23.2,17.2 | 23.2,17.2 23.2,17.8 | 23.2,17.2 23.8,17.2
  Top 1.2: C1.1 23.8,19.1 23.6,18.8 23.6,17.8

### Text on the board
Bottom: @_K4ZUKI_
tPlace: VPP | ISP | GND | TARGET | 1.1 | 0.2 | 0.3 | 0.6 | 0.7 | 0.5 | 0.4 | 0.1 | 0.0 | 1.0 | SWDIO | RESET | 3.3V | SWCLK
bPlace: muRata LBCA2HNZYZ / BLE module breakout
Vscore: V-CUT | V-CUT | V-CUT | V-CUT | V-CUT | V-CUT
_tPlace: U1